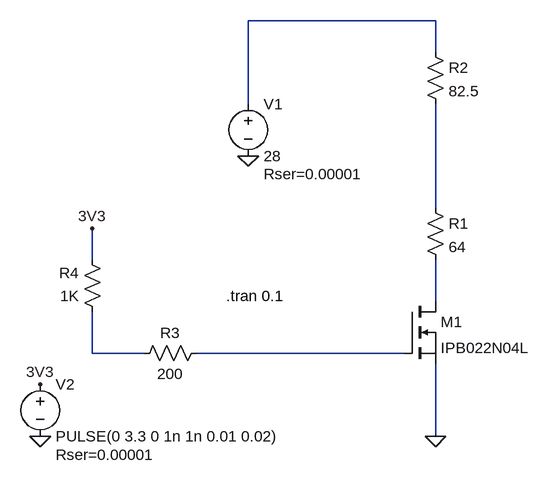
[diagram p0: schematic RelaySwitch.asc]
RelaySwitch.asc, the LTspice schematic file:
Version 4
SHEET 1 880 680
WIRE 160 -144 -128 -144
WIRE 160 -96 160 -144
WIRE -128 -16 -128 -144
WIRE 160 144 160 -16
WIRE -368 224 -368 176
WIRE 160 288 160 224
WIRE -368 368 -368 304
WIRE -288 368 -368 368
WIRE 112 368 -208 368
WIRE 160 496 160 384
FLAG -128 64 0
FLAG 160 496 0
FLAG -448 496 0
FLAG -368 176 3V3
FLAG -448 416 3V3
SYMBOL res 144 128 R0
SYMATTR InstName R1
SYMATTR Value 64
SYMATTR SpiceLine tol=1 pwr=0.1
SYMBOL res 144 -112 R0
SYMATTR InstName R2
SYMATTR Value 82.5
SYMATTR SpiceLine tol=1 pwr=0.1
SYMBOL voltage -128 -32 R0
WINDOW 123 0 0 Left 0
WINDOW 39 24 124 Left 2
SYMATTR InstName V1
SYMATTR Value 28
SYMATTR SpiceLine Rser=0.00001
SYMBOL nmos 112 288 R0
SYMATTR InstName M1
SYMATTR Value IPB022N04L
SYMBOL res -192 352 R90
WINDOW 0 0 56 VBottom 2
WINDOW 3 32 56 VTop 2
SYMATTR InstName R3
SYMATTR Value 200
SYMATTR SpiceLine tol=1 pwr=0.1
SYMBOL res -352 320 R180
WINDOW 0 36 76 Left 2
WINDOW 3 36 40 Left 2
SYMATTR InstName R4
SYMATTR Value 1K
SYMATTR SpiceLine tol=1 pwr=0.1
SYMBOL voltage -448 400 R0
WINDOW 123 0 0 Left 0
WINDOW 39 24 124 Left 2
SYMATTR InstName V2
SYMATTR Value PULSE(0 3.3 0 1n 1n 0.01 0.02)
SYMATTR SpiceLine Rser=0.00001
TEXT -162 280 Left 2 !.tran 0.1

The netlist it stands for:
* RelaySwitch.asc
R1 N002 N003 64 tol=1 pwr=0.1
R2 N001 N002 82.5 tol=1 pwr=0.1
V1 N001 0 28 Rser=0.00001
M1 N003 N005 0 0 IPB022N04L
R3 N005 N004 200 tol=1 pwr=0.1
R4 N004 3V3 1K tol=1 pwr=0.1
V2 3V3 0 PULSE(0 3.3 0 1n 1n 0.01 0.02) Rser=0.00001
.model NMOS NMOS
.model PMOS PMOS
.lib standard.mos
.tran 0.1
.backanno
.end